# Altium schematic sheet Power_MPU.SchDoc: STM32 MPU power
size A3; Date: Not used; ApprovedBy: Not used; CheckedBy: Not used; Author: Not used; CompanyName: STMicroelectronics; DrawnBy: Not used; Engineer: Not used; Organization: Not used; Address1: Not used; Address2: Not used; Address3: Not used; Address4: Not used; DocumentNumber: 4; Revision: Not used; SheetNumber: 4; SheetTotal: 17; CurrentTime: Not used; CurrentDate: Not used; Time: Not used; DocumentFullPathAndName: Not used; DocumentName: Not used; ModifiedDate: Not used; ImagePath: Not used; ProjectName: Not used; Application_BuildNumber: Not used
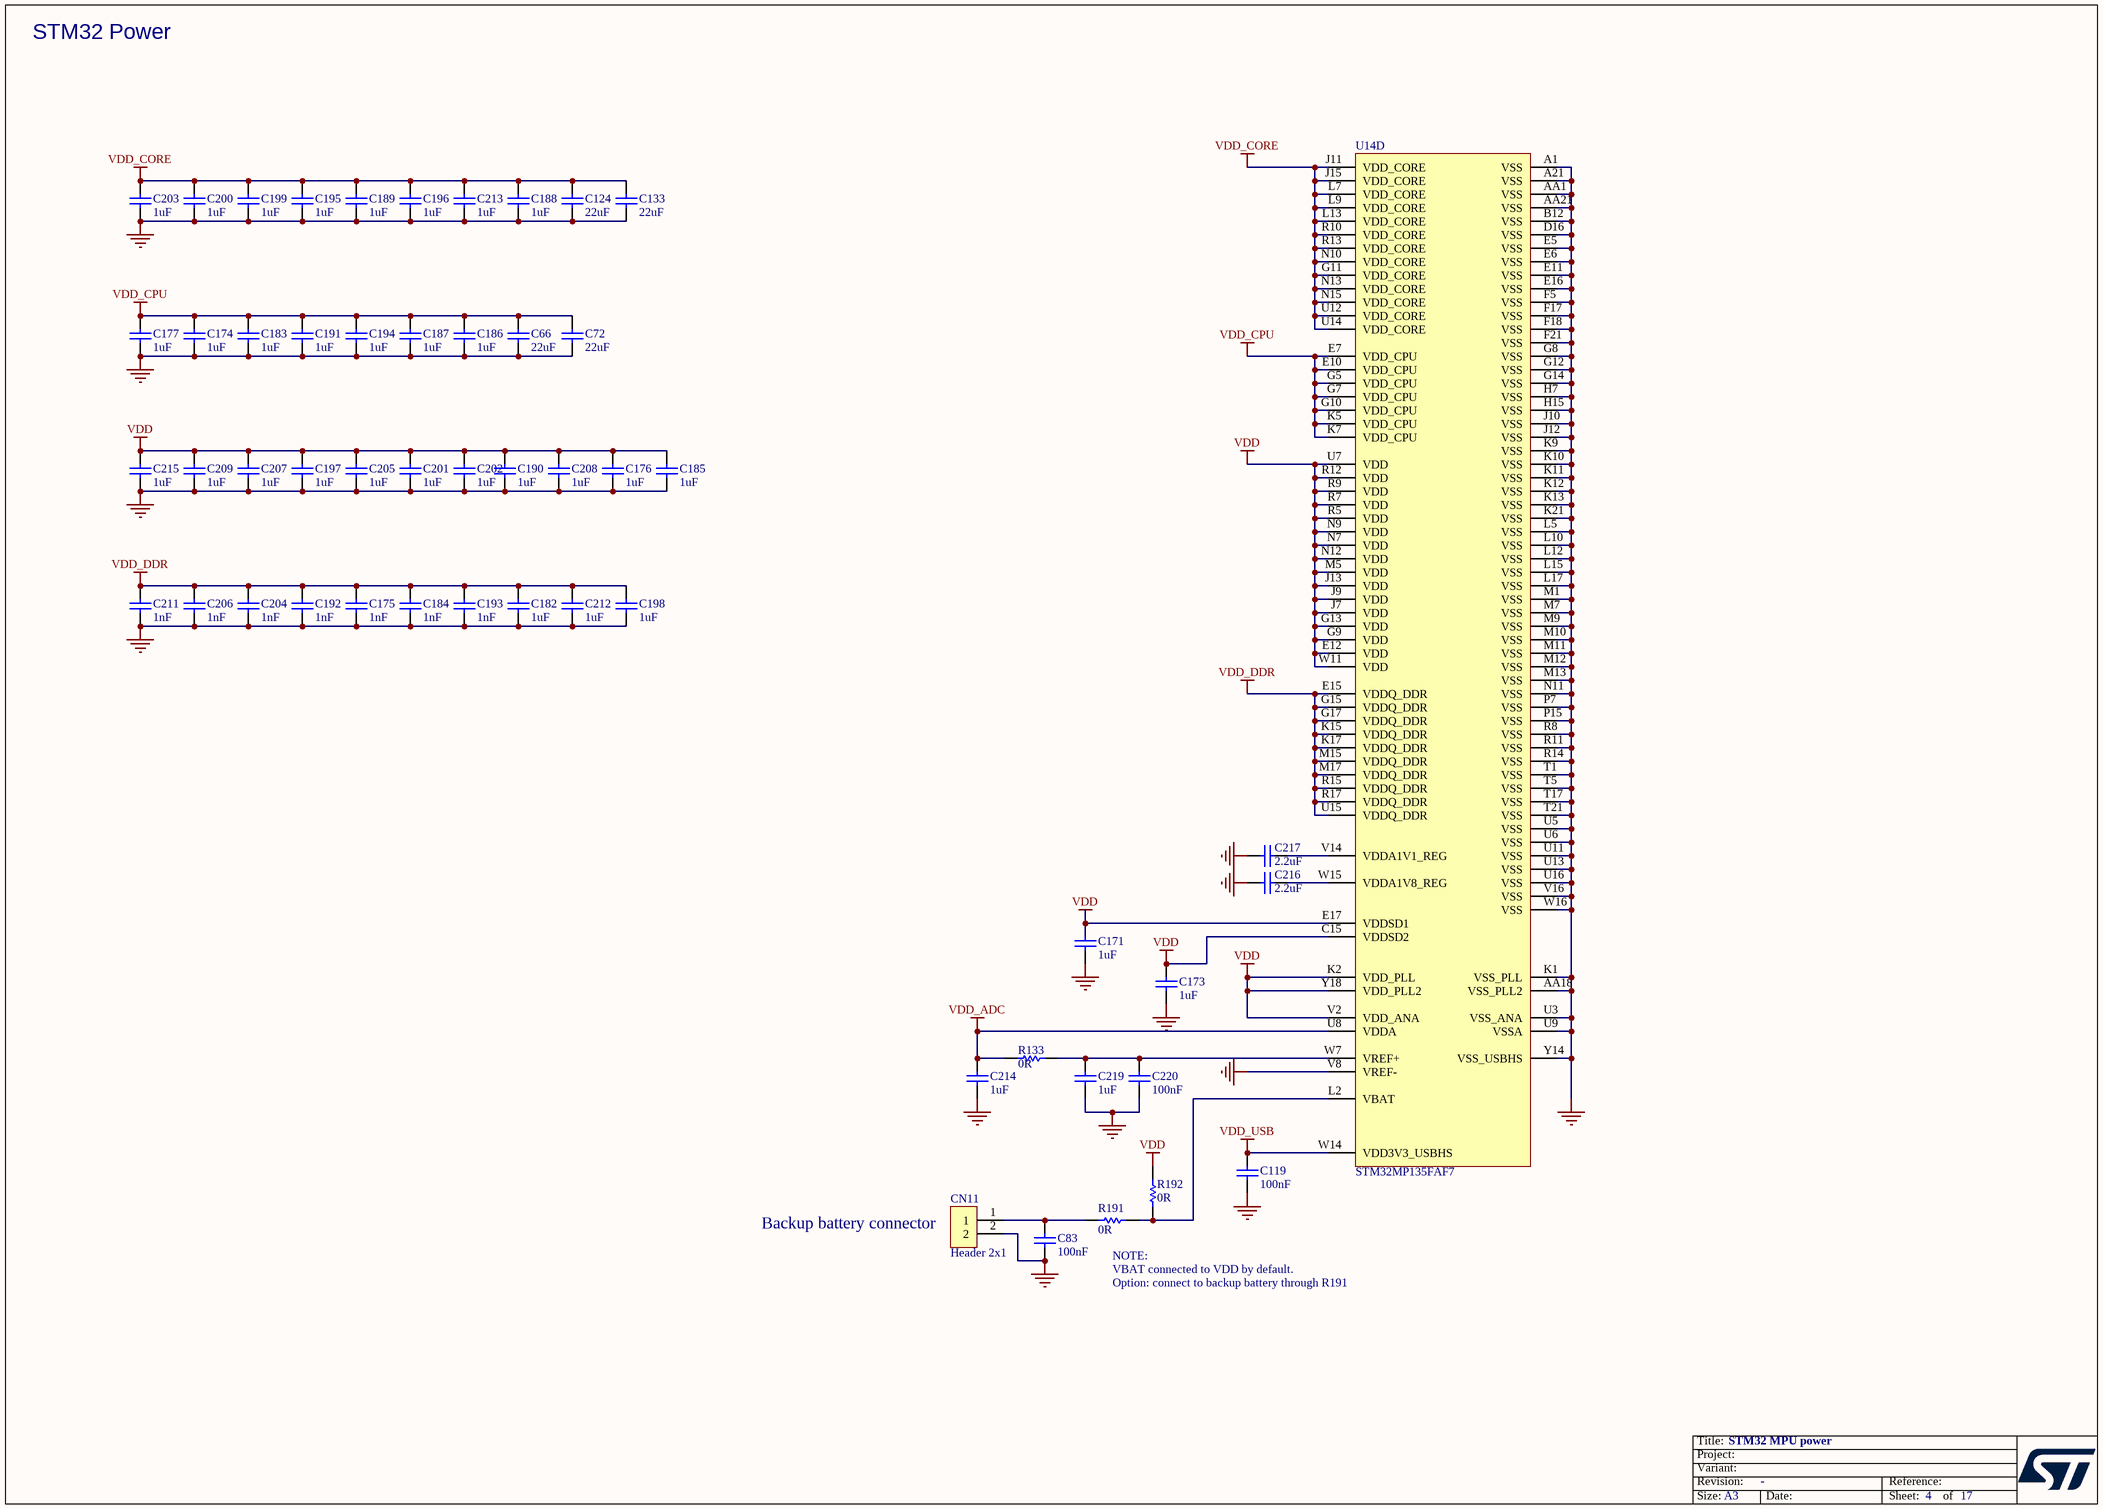
[diagram p0: Power_MPU.SchDoc]

## Parts
C66  value 22uF  [C0603]  (hidden comment: Capacitor)
C72  value 22uF  [C0603]  (hidden comment: Capacitor)
C83  value 100nF  [C0402]  (hidden comment: Capacitor)
C119  value 100nF  [C0402]  (hidden comment: Capacitor)
C124  value 22uF  [C0603]  (hidden comment: Capacitor)
C133  value 22uF  [C0603]  (hidden comment: Capacitor)
C171  value 1uF  [C0201_MURATA_GRM033_H0P3]  (hidden comment: Capacitor)
C173  value 1uF  [C0201_MURATA_GRM033_H0P3]  (hidden comment: Capacitor)
C174  value 1uF  [C0201_MURATA_GRM033_H0P3]  (hidden comment: Capacitor)
C175  value 1nF  [C0201_MURATA_GRM033_H0P3]  (hidden comment: Capacitor)
C176  value 1uF  [C0201_MURATA_GRM033_H0P3]  (hidden comment: Capacitor)
C177  value 1uF  [C0201_MURATA_GRM033_H0P3]  (hidden comment: Capacitor)
C182  value 1uF  [C0201_MURATA_GRM033_H0P3]  (hidden comment: Capacitor)
C183  value 1uF  [C0201_MURATA_GRM033_H0P3]  (hidden comment: Capacitor)
C184  value 1nF  [C0201_MURATA_GRM033_H0P3]  (hidden comment: Capacitor)
C185  value 1uF  [C0201_MURATA_GRM033_H0P3]  (hidden comment: Capacitor)
C186  value 1uF  [C0201_MURATA_GRM033_H0P3]  (hidden comment: Capacitor)
C187  value 1uF  [C0201_MURATA_GRM033_H0P3]  (hidden comment: Capacitor)
C188  value 1uF  [C0201_MURATA_GRM033_H0P3]  (hidden comment: Capacitor)
C189  value 1uF  [C0201_MURATA_GRM033_H0P3]  (hidden comment: Capacitor)
C190  value 1uF  [C0201_MURATA_GRM033_H0P3]  (hidden comment: Capacitor)
C191  value 1uF  [C0201_MURATA_GRM033_H0P3]  (hidden comment: Capacitor)
C192  value 1nF  [C0201_MURATA_GRM033_H0P3]  (hidden comment: Capacitor)
C193  value 1nF  [C0201_MURATA_GRM033_H0P3]  (hidden comment: Capacitor)
C194  value 1uF  [C0201_MURATA_GRM033_H0P3]  (hidden comment: Capacitor)
C195  value 1uF  [C0201_MURATA_GRM033_H0P3]  (hidden comment: Capacitor)
C196  value 1uF  [C0201_MURATA_GRM033_H0P3]  (hidden comment: Capacitor)
C197  value 1uF  [C0201_MURATA_GRM033_H0P3]  (hidden comment: Capacitor)
C198  value 1uF  [C0201_MURATA_GRM033_H0P3]  (hidden comment: Capacitor)
C199  value 1uF  [C0201_MURATA_GRM033_H0P3]  (hidden comment: Capacitor)
C200  value 1uF  [C0201_MURATA_GRM033_H0P3]  (hidden comment: Capacitor)
C201  value 1uF  [C0201_MURATA_GRM033_H0P3]  (hidden comment: Capacitor)
C202  value 1uF  [C0201_MURATA_GRM033_H0P3]  (hidden comment: Capacitor)
C203  value 1uF  [C0201_MURATA_GRM033_H0P3]  (hidden comment: Capacitor)
C204  value 1nF  [C0201_MURATA_GRM033_H0P3]  (hidden comment: Capacitor)
C205  value 1uF  [C0201_MURATA_GRM033_H0P3]  (hidden comment: Capacitor)
C206  value 1nF  [C0201_MURATA_GRM033_H0P3]  (hidden comment: Capacitor)
C207  value 1uF  [C0201_MURATA_GRM033_H0P3]  (hidden comment: Capacitor)
C208  value 1uF  [C0201_MURATA_GRM033_H0P3]  (hidden comment: Capacitor)
C209  value 1uF  [C0201_MURATA_GRM033_H0P3]  (hidden comment: Capacitor)
C211  value 1nF  [C0201_MURATA_GRM033_H0P3]  (hidden comment: Capacitor)
C212  value 1uF  [C0201_MURATA_GRM033_H0P3]  (hidden comment: Capacitor)
C213  value 1uF  [C0201_MURATA_GRM033_H0P3]  (hidden comment: Capacitor)
C214  value 1uF  [C0201_MURATA_GRM033_H0P3]  (hidden comment: Capacitor)
C215  value 1uF  [C0201_MURATA_GRM033_H0P3]  (hidden comment: Capacitor)
C216  value 2.2uF  [C0201_H0P5]  (hidden comment: Capacitor)
C217  value 2.2uF  [C0201_H0P5]  (hidden comment: Capacitor)
C219  value 1uF  [C0201_MURATA_GRM033_H0P3]  (hidden comment: Capacitor)
C220  value 100nF  [C0402]  (hidden comment: Capacitor)
CN11  Header 2x1  [CON_MOLEX_53047-0210]
R133  value 0R  [R0402]  (hidden comment: Resistor)
R191  value 0R  [R0402]  (hidden comment: Resistor)
R192  value 0R  [R0402]  (hidden comment: Resistor)
U14  STM32MP135FAF7  [ICC_TFBGA320_11X11_STM32MP135FA7_P050_H1P20]  (part D of 5)

## Nets
GND: C66.1 C72.1 C83.1 C119.1 C124.1 C133.1 C171.1 C173.1 C174.1 C175.1 C176.1 C177.2 C182.1 C183.1 C184.1 C185.2 C186.1 C187.1 C188.1 C189.1 C190.1 C191.2 C192.1 C193.1 C194.1 C195.2 C196.1 C197.1 C198.1 C199.1 C200.1 C201.1 C202.1 C203.2 C204.2 C205.1 C206.1 C207.2 C208.1 C209.1 C211.1 C212.1 C213.1 C214.2 C215.2 C216.2 C217.2 C219.2 C220.1 CN11.2 U14.A1(VSS) U14.A21(VSS) U14.AA1(VSS) U14.AA18(VSS_PLL2) U14.AA21(VSS) U14.B12(VSS) U14.D16(VSS) U14.E5(VSS) U14.E6(VSS) U14.E11(VSS) U14.E16(VSS) U14.F5(VSS) U14.F17(VSS) U14.F18(VSS) U14.F21(VSS) U14.G8(VSS) U14.G12(VSS) U14.G14(VSS) U14.H7(VSS) U14.H15(VSS) U14.J10(VSS) U14.J12(VSS) U14.K1(VSS_PLL) U14.K9(VSS) U14.K10(VSS) U14.K11(VSS) U14.K12(VSS) U14.K13(VSS) U14.K21(VSS) U14.L5(VSS) U14.L10(VSS) U14.L12(VSS) U14.L15(VSS) U14.L17(VSS) U14.M1(VSS) U14.M7(VSS) U14.M9(VSS) U14.M10(VSS) U14.M11(VSS) U14.M12(VSS) U14.M13(VSS) U14.N11(VSS) U14.P7(VSS) U14.P15(VSS) U14.R8(VSS) U14.R11(VSS) U14.R14(VSS) U14.T1(VSS) U14.T5(VSS) U14.T17(VSS) U14.T21(VSS) U14.U3(VSS_ANA) U14.U5(VSS) U14.U6(VSS) U14.U9(VSSA) U14.U11(VSS) U14.U13(VSS) U14.U16(VSS) U14.V8(VREF-) U14.V16(VSS) U14.W16(VSS) U14.Y14(VSS_USBHS)
VDD: C171.2 C173.2 C176.2 C185.1 C190.2 C197.2 C201.2 C202.2 C205.2 C207.1 C208.2 C209.2 C215.1 R192.2 U14.C15(VDDSD2) U14.E12(VDD) U14.E17(VDDSD1) U14.G9(VDD) U14.G13(VDD) U14.J7(VDD) U14.J9(VDD) U14.J13(VDD) U14.K2(VDD_PLL) U14.M5(VDD) U14.N7(VDD) U14.N9(VDD) U14.N12(VDD) U14.R5(VDD) U14.R7(VDD) U14.R9(VDD) U14.R12(VDD) U14.U7(VDD) U14.V2(VDD_ANA) U14.W11(VDD) U14.Y18(VDD_PLL2)
VDD_ADC: C214.1 R133.2 U14.U8(VDDA)
VDD_CORE: C124.2 C133.2 C188.2 C189.2 C195.1 C196.2 C199.2 C200.2 C203.1 C213.2 U14.G11(VDD_CORE) U14.J11(VDD_CORE) U14.J15(VDD_CORE) U14.L7(VDD_CORE) U14.L9(VDD_CORE) U14.L13(VDD_CORE) U14.N10(VDD_CORE) U14.N13(VDD_CORE) U14.N15(VDD_CORE) U14.R10(VDD_CORE) U14.R13(VDD_CORE) U14.U12(VDD_CORE) U14.U14(VDD_CORE)
VDD_CPU: C66.2 C72.2 C174.2 C177.1 C183.2 C186.2 C187.2 C191.1 C194.2 U14.E7(VDD_CPU) U14.E10(VDD_CPU) U14.G5(VDD_CPU) U14.G7(VDD_CPU) U14.G10(VDD_CPU) U14.K5(VDD_CPU) U14.K7(VDD_CPU)
VDD_DDR: C175.2 C182.2 C184.2 C192.2 C193.2 C198.2 C204.1 C206.2 C211.2 C212.2 U14.E15(VDDQ_DDR) U14.G15(VDDQ_DDR) U14.G17(VDDQ_DDR) U14.K15(VDDQ_DDR) U14.K17(VDDQ_DDR) U14.M15(VDDQ_DDR) U14.M17(VDDQ_DDR) U14.R15(VDDQ_DDR) U14.R17(VDDQ_DDR) U14.U15(VDDQ_DDR)
VDD_USB: C119.2 U14.W14(VDD3V3_USBHS)
NetC83_2: C83.2 CN11.1 R191.2
NetC216_1: C216.1 U14.W15(VDDA1V8_REG)
NetC217_1: C217.1 U14.V14(VDDA1V1_REG)
NetC219_1: C219.1 C220.2 R133.1 U14.W7(VREF+)
NetR191_1: R191.1 R192.1 U14.L2(VBAT)

## Notes on the sheet
- STM32 Power
- (near CN11) Backup battery connector
- NOTE:
  VBAT connected to VDD by default.
  Option: connect to backup battery through R191
- Title:
- Project:
- Size:
- Revision:
- Variant:
- A3
- -
- Date:
- Reference:
- Sheet:
- of

## Library data of the parts
C66 C72 C124 C133 = MCD-00100: Capacitor, MLCC, 22uF, 6V3, X5R, +/-20%, 0603, T=0.8mm; Part_Preference: Recommended; Manufacturer: MURATA; Manufacturer_Part_Number: GRM188R60J226MEA0J; Component_Country_Of_Origin: Japan; ShowFields: YES; ID: 2766; Internal_Part_Number: MCD-00100; Status: Released; Part_Type: Capacitor; Package: 0603; ComponentLink1URL: http://tunmcdsvn.tun.st.com/Component_Documentation_Library/Trunk/Capacitor/MURATA_GRM_Series; Order_Code_Digikey: 490-7612-2-ND; Order_Code_Farnell: N/A; Order_Code_RS: N/A
C83 C119 C220 = MCD-00006: Capacitor, MLCC, 100nF, 16V, X7R, +/-10%, 0402, T=0.5mm; Manufacturer_Part_Number: CC0402KRX7R7BB104; Manufacturer: YAGEO; Part_Preference: Recommended; Order_Code_RS: 616-9701; Component_Country_Of_Origin: China; ShowFields: YES; ID: 2474; Internal_Part_Number: MCD-00006; Status: Released; Part_Type: Capacitor; Package: 0402; ComponentLink1URL: http://tunmcdsvn.tun.st.com/Component_Documentation_Library/Trunk/Capacitor/YAGEO_X7R_Series; Order_Code_Digikey: 311-1338-1-ND; Order_Code_Farnell: 9402047
C171 C173 C174 C176 C177 C182 C183 C185-C191 C194-C203 C205 C207-C209 C212-C215 C219 = MCD-02377: Capacitor, MLCC, 1uF, 6.3V, X5R, +/-20%, 0201, T=0,3mm; Part_Preference: Recommended; Manufacturer: MURATA; Manufacturer_Part_Number: GRM033R60J105MEA2; Order_Code_RS: 820-0643; Component_Country_Of_Origin: Japan; ShowFields: YES; ID: 4483; Status: Checked; Internal_Part_Number: MCD-02377; Part_Type: Capacitor; Package: 0201; ComponentLink1URL: http://tunmcdsvn.tun.st.com/Component_Documentation_Library/Trunk/Capacitor/MURATA_GRM_Series/GRM033R60J105MEA2/; Order_Code_Digikey: 490-7229-2-ND; Order_Code_Farnell: 2470448
C175 C184 C192 C193 C204 C206 C211 = MCD-01729: Capacitor, MLCC, 1nF, 25V, X7R,+/-5%, 0201,T=0.3mm; Part_Preference: Recommended; Manufacturer: MURATA; Manufacturer_Part_Number: GRM033R71E102JA01D; Order_Code_RS: 185-1954; Component_Country_Of_Origin: Japan; ShowFields: YES; ID: 3829; Status: Released; Internal_Part_Number: MCD-01729; Part_Type: Capacitor; Package: 0201; ComponentLink1URL: http://tunmcdsvn.tun.st.com/Component_Documentation_Library/Trunk/Capacitor/MURATA_GRM_Series; Order_Code_Digikey: 490-16360-1-ND; Order_Code_Farnell: 2999504
C216 C217 = MCD-02235: Capacitor, MLCC, 2.2uF, 10V, X5R,+/-10%, 0201, T=0.5mm; Manufacturer_Part_Number: GRM033R61A225KE47D; Manufacturer: MURATA; Part_Preference: Recommended; Order_Code_RS: NA; Component_Country_Of_Origin: Japan; ShowFields: YES; ID: 4335; Internal_Part_Number: MCD-02235; Status: Checked; Part_Type: Capacitor; Package: 0201; ComponentLink1URL: http://tunmcdsvn.tun.st.com/Component_Documentation_Library/Trunk/Capacitor/MURATA_GRM_Series; Order_Code_Digikey: 490-13227-1-ND; Order_Code_Farnell: NA
CN11 = MCD-00655: Header, 2x1, 1.25mm, VR, TH, T=2.25mm/2.3mm; Part_Type: Connector; Manufacturer_Part_Number: 53047-0210; Manufacturer: MOLEX; BMS_Part_Number: 9083002; Part_Preference: Recommended; Order_Code_RS: 279-9213; Component_Country_Of_Origin: Unknown; ShowFields: YES; ID: 3091; Internal_Part_Number: MCD-00655; Value: Header 2x1; Status: Checked; ComponentLink1URL: http://tunmcdsvn.tun.st.com/Component_Documentation_Library/Trunk/Connector/MOLEX_53047-0210/; Order_Code_Digikey: WM1731-ND; Order_Code_Farnell: 9733051
R133 R191 R192 = MCD-00052: Resistor, 0R, 0402, +/-5%, 1/16W; Manufacturer_Part_Number: RC0402JR-070RL; Manufacturer: YAGEO; Part_Preference: Recommended; Order_Code_RS: 618-5804; Component_Country_Of_Origin: China; ShowFields: YES; ID: 2540; Internal_Part_Number: MCD-00052; Status: Released; Part_Type: Resistor; ComponentLink1URL: http://tunmcdsvn.tun.st.com/Component_Documentation_Library/Trunk/Resistor/YAGEO_RC_L_Series; Package: 0402; Order_Code_Digikey: 311-0.0JRCT-ND; Order_Code_Farnell: 9232516RL
U14 = MCD-02251: Cortex-A7 @ 900MHz, 128KB-ROM, 128KB-SRAM, 2x Ethernet, 2x ADC, 2x CAN FD, TSC, Camera, Display, Secure Boot, Cryptography, DRAM enc/dec, PKA; Part_Preference: Recommended; Part_Type: IC; Manufacturer: STMICROELECTRONICS; Manufacturer_HQ_COO: EU; Component_Country_Of_Origin: Unknown; ShowFields: YES; ID: 4351; Internal_Part_Number: MCD-02251; Value: STM32MP135FAF7; Status: Checked; Manufacturer_Part_Number: STM32MP135FAF7; Package: TFBGA320; ComponentLink1URL: http://tunmcdsvn.tun.st.com/Component_Datasheet_Library/Trunk/Socket_IC/STM_MPU_STM32MP135FAF7_Socket; Order_Code_Digikey: N/A; Order_Code_Farnell: N/A; Order_Code_RS: N/A